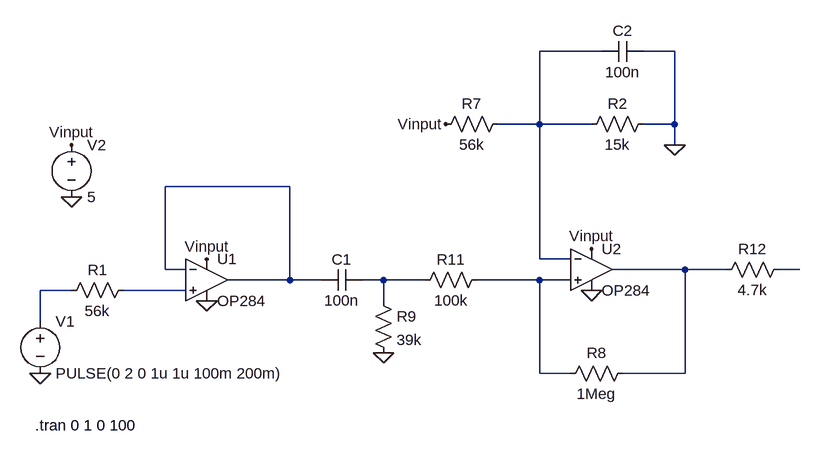
[diagram p0: schematic wind_speed_schematic.asc]
wind_speed_schematic.asc, the LTspice schematic file:
Version 4
SHEET 1 1860 680
WIRE 1008 -304 912 -304
WIRE 1120 -304 1072 -304
WIRE 912 -192 912 -304
WIRE 912 -192 848 -192
WIRE 992 -192 912 -192
WIRE 1120 -192 1120 -304
WIRE 1120 -192 1072 -192
WIRE 1120 -160 1120 -192
WIRE 528 -96 336 -96
WIRE 912 16 912 -192
WIRE 960 16 912 16
WIRE 336 32 336 -96
WIRE 368 32 336 32
WIRE 1136 32 1024 32
WIRE 1200 32 1136 32
WIRE 1312 32 1280 32
WIRE 528 48 528 -96
WIRE 528 48 432 48
WIRE 576 48 528 48
WIRE 672 48 640 48
WIRE 736 48 672 48
WIRE 912 48 816 48
WIRE 960 48 912 48
WIRE 192 64 144 64
WIRE 368 64 272 64
WIRE 672 80 672 48
WIRE 144 112 144 64
WIRE 912 192 912 48
WIRE 960 192 912 192
WIRE 1136 192 1136 32
WIRE 1136 192 1040 192
FLAG 192 -160 Vinput
FLAG 192 -80 0
FLAG 400 80 0
FLAG 400 16 Vinput
FLAG 144 192 0
FLAG 992 64 0
FLAG 992 0 Vinput
FLAG 768 -192 Vinput
FLAG 1120 -160 0
FLAG 672 160 0
SYMBOL voltage 144 96 R0
WINDOW 123 0 0 Left 0
WINDOW 39 0 0 Left 0
SYMATTR InstName V1
SYMATTR Value PULSE(0 2 0 1u 1u 100m 200m)
SYMBOL res 288 48 R90
WINDOW 0 0 56 VBottom 2
WINDOW 3 32 56 VTop 2
SYMATTR InstName R1
SYMATTR Value 56k
SYMBOL OpAmps\\OP284 400 -16 R0
SYMATTR InstName U1
SYMBOL voltage 192 -176 R0
WINDOW 123 0 0 Left 0
WINDOW 39 0 0 Left 0
SYMATTR InstName V2
SYMATTR Value 5
SYMBOL cap 640 32 R90
WINDOW 0 0 32 VBottom 2
WINDOW 3 32 32 VTop 2
SYMATTR InstName C1
SYMATTR Value 100n
SYMBOL res 656 64 R0
SYMATTR InstName R9
SYMATTR Value 39k
SYMBOL res 1088 -208 R90
WINDOW 0 0 56 VBottom 2
WINDOW 3 32 56 VTop 2
SYMATTR InstName R2
SYMATTR Value 15k
SYMBOL res 864 -208 R90
WINDOW 0 0 56 VBottom 2
WINDOW 3 32 56 VTop 2
SYMATTR InstName R7
SYMATTR Value 56k
SYMBOL res 1056 176 R90
WINDOW 0 0 56 VBottom 2
WINDOW 3 32 56 VTop 2
SYMATTR InstName R8
SYMATTR Value 1Meg
SYMBOL res 832 32 R90
WINDOW 0 0 56 VBottom 2
WINDOW 3 32 56 VTop 2
SYMATTR InstName R11
SYMATTR Value 100k
SYMBOL OpAmps\\OP284 992 -32 R0
SYMATTR InstName U2
SYMBOL res 1296 16 R90
WINDOW 0 0 56 VBottom 2
WINDOW 3 32 56 VTop 2
SYMATTR InstName R12
SYMATTR Value 4.7k
SYMBOL cap 1072 -320 R90
WINDOW 0 0 32 VBottom 2
WINDOW 3 32 32 VTop 2
SYMATTR InstName C2
SYMATTR Value 100n
TEXT 136 272 Left 2 !.tran 0 1 0 100

The netlist it stands for:
* wind_speed_schematic.asc
V1 N007 0 PULSE(0 2 0 1u 1u 100m 200m)
R1 N008 N007 56k
XU1 N008 N002 Vinput 0 N002 OP284  ; pins In+ In- V+ V- OUT
V2 Vinput 0 5
C1 N005 N002 100n
R9 N005 0 39k
R2 0 N001 15k
R7 N001 Vinput 56k
R8 N003 N006 1Meg
R11 N006 N005 100k
XU2 N006 N001 Vinput 0 N003 OP284  ; pins In+ In- V+ V- OUT
R12 N004 N003 4.7k
C2 0 N001 100n
.tran 0 1 0 100
.lib ADI1.lib
.backanno
.end